# EAGLE design stm32f103_fc (EAGLE 9.3.0)
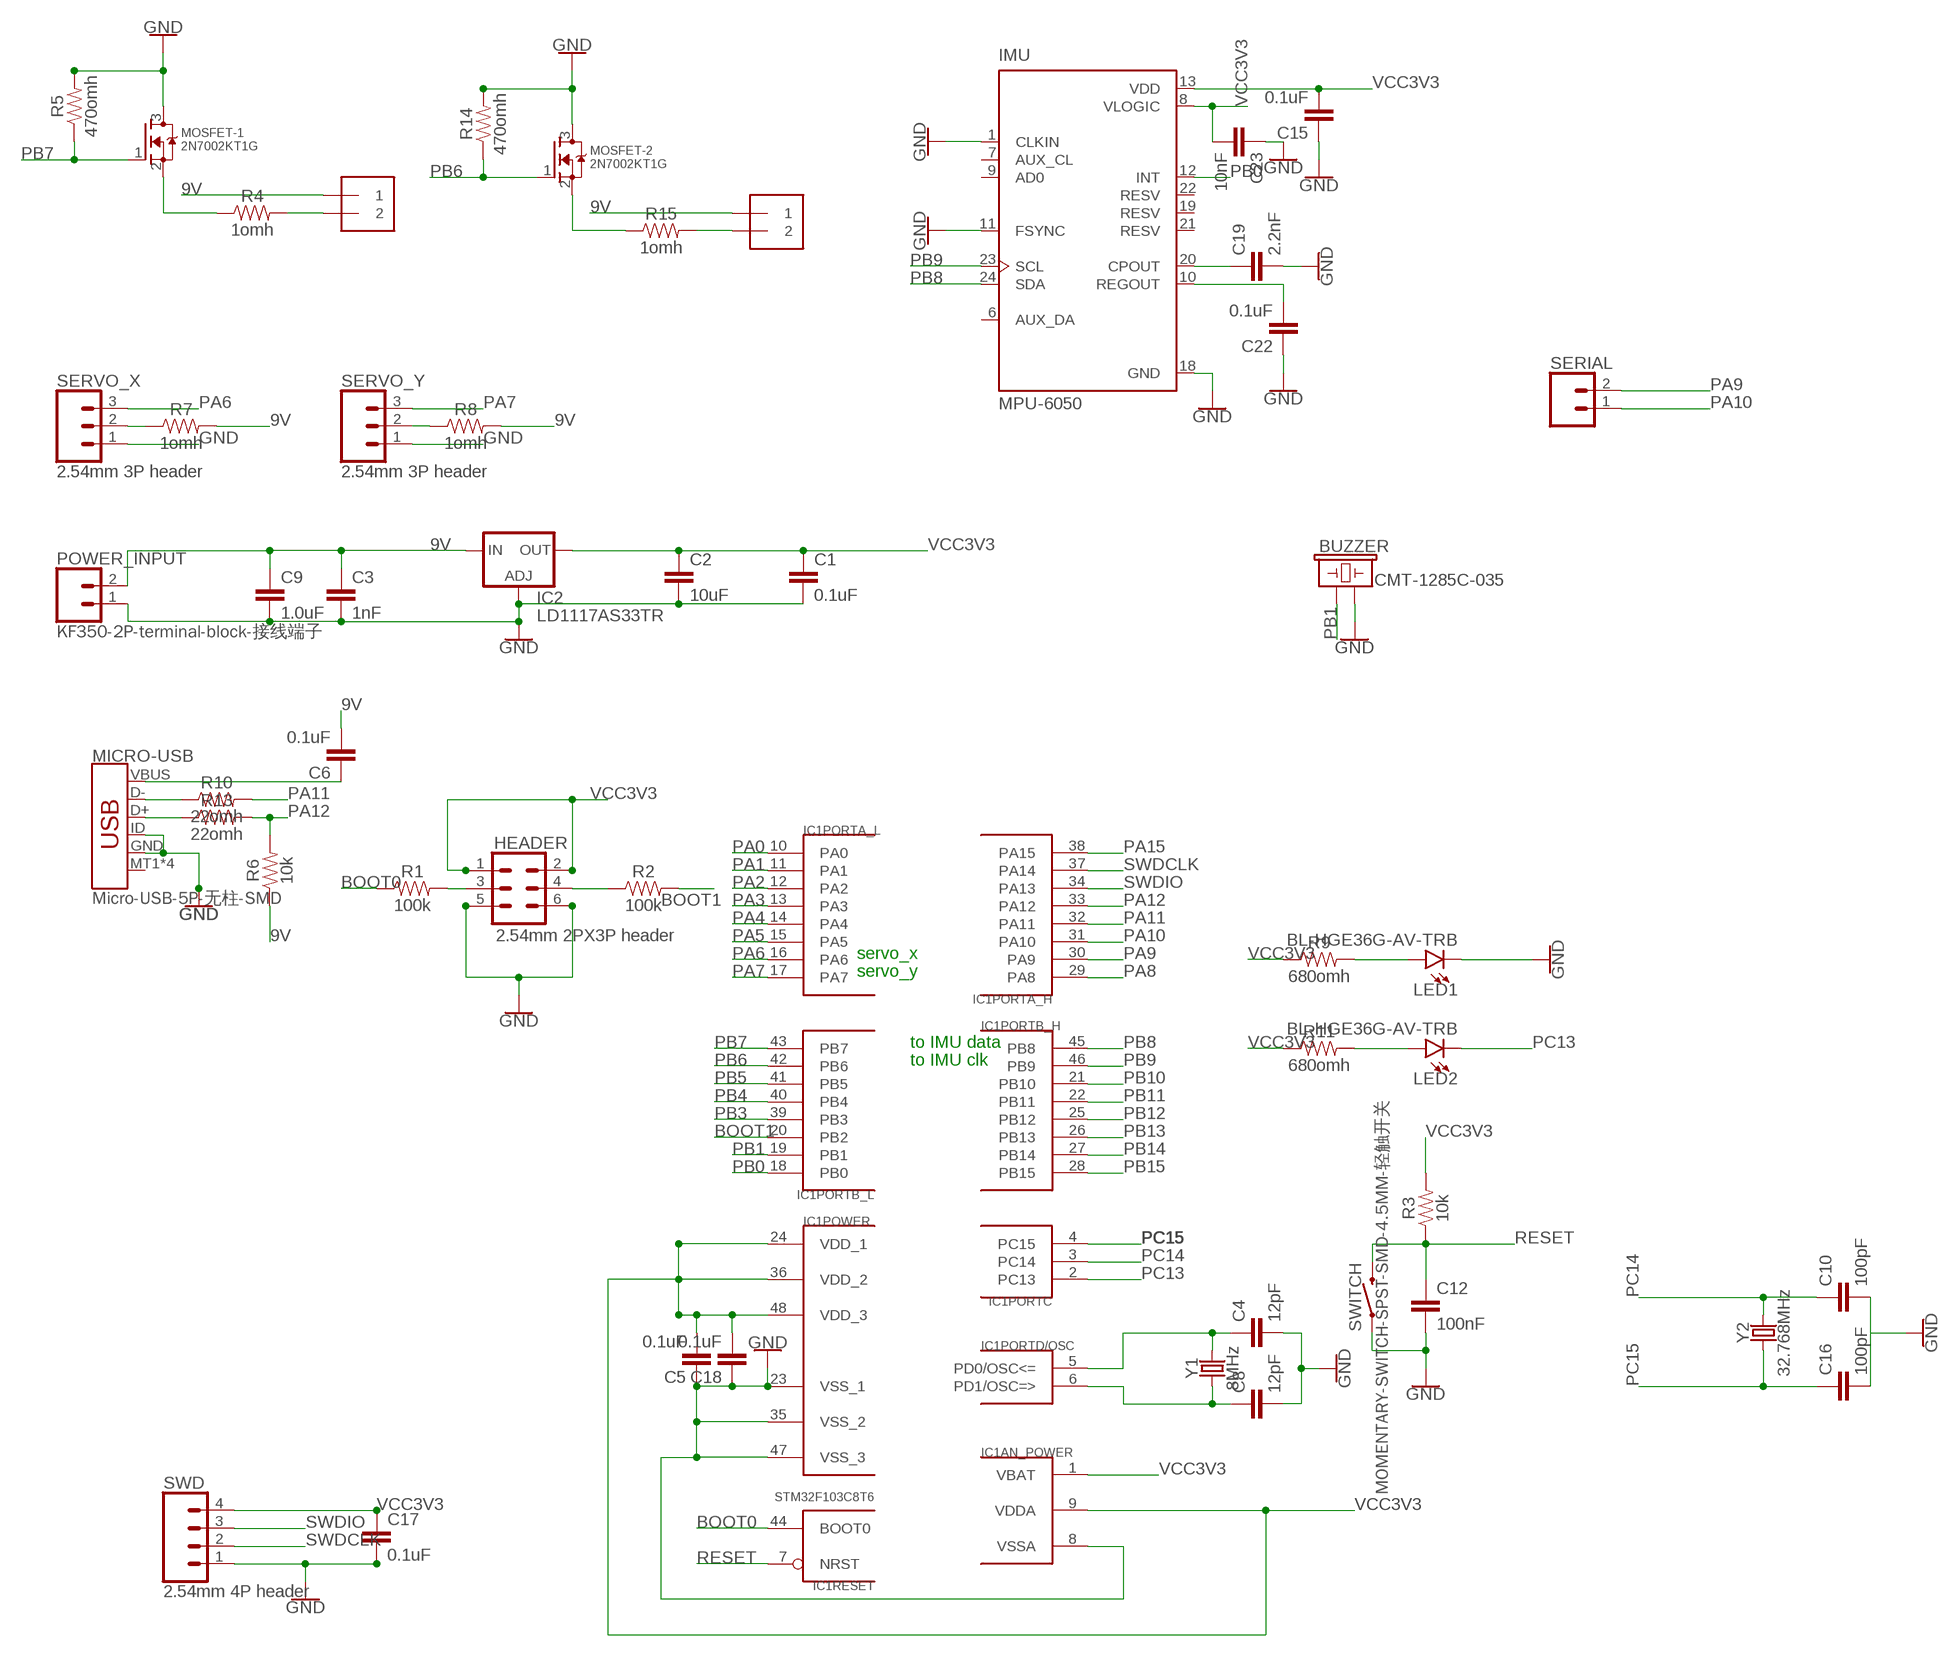
[diagram p0: schematic, sheet 1]

## Parts
BUZZER  CMT-1285C-035  BUZZER-PTH  [BUZZER-12MM]
C1  0.1uF  0.1UF-0603-25V-(+80/-20%)  [0603]
C2  10uF  10UF-0603-6.3V-20%  [0603]
C3  1nF  1.0NF/1000PF-0603-50V-10%  [0603]
C4  12pF  12PF-0603-50V-5%  [0603]
C5  0.1uF  0.1UF-0402-16V-10%  [0402]
C6  0.1uF  0.1UF-0603-25V-(+80/-20%)  [0603]
C8  12pF  12PF-0603-50V-5%  [0603]
C9  1.0uF  1.0UF-0603-16V-10%  [0603]
C10  100pF  100PF-0603-50V-5%  [0603]
C12  100nF  0.1UF-0603-25V-(+80/-20%)  [0603]
C15  0.1uF  0.1UF-0402-16V-10%  [0402]
C16  100pF  100PF-0603-50V-5%  [0603]
C17  0.1uF  0.1UF-0603-25V-(+80/-20%)  [0603]
C18  0.1uF  0.1UF-0402-16V-10%  [0402]
C19  2.2nF  2.2NF/2200PF-0603-50V-10%  [0603]
C22  0.1uF  0.1UF-0402-16V-10%  [0402]
C23  10nF  10NF-0603-50V-10%  [0603]
HEADER  2.54mm 2PX3P header  CONN_03X2NO_SILK  [2X3-NS]
IC1  STM32F103C8T6  STM32F10XCXT6  [TQFP48]
IC2  LD1117AS33TR  LD117AS33TR  [SOT223]
IMU  MPU-6050  [QFN50P400X400X95-24N]
LED1  BL-HGE36G-AV-TRB  LED-GREEN0603  [LED-0603]
LED2  BL-HGE36G-AV-TRB  LED-GREEN0603  [LED-0603]
MICRO-USB  Micro-USB-5P-无柱-SMD  USB_MICRO-B_SMT  [USB-MICROB]
MOSFET-1  2N7002KT1G  MOSFET-NREFLOW  [SOT23]
MOSFET-2  2N7002KT1G  MOSFET-NREFLOW  [SOT23]
POWER_INPUT  KF350-2P-terminal-block-接线端子  CONN_023.5MM  [SCREWTERMINAL-3.5MM-2]
PY1  1X2-3.5MM KF350 terminal block  1X2-3.5MM  [1X2-3.5MM]
PY2  1X2-3.5MM KF350 terminal block  1X2-3.5MM  [1X2-3.5MM]
R1  100k  100KOHM-0603-1/10W-1%  [0603]
R2  100k  100KOHM-0603-1/10W-1%  [0603]
R3  10k  10KOHM-0603-1/10W-1%  [0603]
R4  1omh  1OHM-0603-1/10W-1%  [0603]
R5  470omh  470OHM-0603-1/10W-1%  [0603]
R6  10k  10KOHM-0603-1/10W-1%  [0603]
R7  1omh  1OHM-0603-1/10W-1%  [0603]
R8  1omh  1OHM-0603-1/10W-1%  [0603]
R9  680omh  680OHM-0603-1/10W-5%  [0603]
R10  22omh  22OHM-0603-1/10W-1%  [0603]
R11  680omh  680OHM-0603-1/10W-5%  [0603]
R13  22omh  22OHM-0603-1/10W-1%  [0603]
R14  470omh  470OHM-0603-1/10W-1%  [0603]
R15  1omh  1OHM-0603-1/10W-1%  [0603]
SERIAL  CONN_02  [1X02]
SERVO_X  2.54mm 3P header  CONN_03  [1X03]
SERVO_Y  2.54mm 3P header  CONN_03  [1X03]
SWD  2.54mm 4P header  CONN_04  [1X04]
SWITCH  MOMENTARY-SWITCH-SPST-SMD-4.5MM-轻触开关  MOMENTARY-SWITCH-SPST-SMD-6.0X3.5MM  [TACTILE_SWITCH_SMD_6.0X3.5MM]
Y1  8MHz  CRYSTALPTH-HC49US  [HC49US]
Y2  32.768MHz  CRYSTALPTH-HC49US  [HC49US]

## Nets
9V: C3.1 C6.2 C9.1 IC2.3(IN) POWER_INPUT.2 PY1.1 PY2.1 R6.1 R7.2 R8.2
BOOT0: IC1.44(RESET:BOOT0) R1.1
BOOT1: IC1.20(PORTB_L:PB2) R2.2
GND: BUZZER.- C1.2 C2.2 C3.2 C4.2 C5.1 C8.2 C9.2 C10.2 C12.2 C15.1 C16.2 C17.2 C18.1 C19.2 C22.1 C23.1 HEADER.5 HEADER.6 IC1.8(AN_POWER:VSSA) IC1.23(POWER:VSS_1) IC1.35(POWER:VSS_2) IC1.47(POWER:VSS_3) IC2.1(ADJ) IMU.1(CLKIN) IMU.11(FSYNC) IMU.18(GND) LED1.C MICRO-USB.GND MICRO-USB.ID MOSFET-1.3(D) MOSFET-2.3(D) POWER_INPUT.1 R5.2 R14.2 SERVO_X.1 SERVO_Y.1 SWD.1 SWITCH.1
N$1: HEADER.3 R1.2
N$2: HEADER.4 R2.1
N$3: LED1.A R9.2
N$4: C19.1 IMU.20(CPOUT)
N$5: LED2.A R11.2
N$6: MICRO-USB.D- R10.1
N$7: C4.1 IC1.5(PORTD/OSC:PD0/OSC<=) Y1.2
N$8: MICRO-USB.D+ R13.1
N$9: C8.1 IC1.6(PORTD/OSC:PD1/OSC=>) Y1.1
N$10: C6.1 MICRO-USB.VBUS
N$11: PY1.2 R4.2
N$12: PY2.2 R15.2
N$13: MOSFET-2.2(S) R15.1
N$14: MOSFET-1.2(S) R4.1
N$16: C22.2 IMU.10(REGOUT)
N$17: R7.1 SERVO_X.2
N$18: R8.1 SERVO_Y.2
PA0: IC1.10(PORTA_L:PA0)
PA1: IC1.11(PORTA_L:PA1)
PA2: IC1.12(PORTA_L:PA2)
PA3: IC1.13(PORTA_L:PA3)
PA4: IC1.14(PORTA_L:PA4)
PA5: IC1.15(PORTA_L:PA5)
PA6: IC1.16(PORTA_L:PA6) SERVO_X.3
PA7: IC1.17(PORTA_L:PA7) SERVO_Y.3
PA8: IC1.29(PORTA_H:PA8)
PA9: IC1.30(PORTA_H:PA9) SERIAL.2
PA10: IC1.31(PORTA_H:PA10) SERIAL.1
PA11: IC1.32(PORTA_H:PA11) R10.2
PA12: IC1.33(PORTA_H:PA12) R6.2 R13.2
PA15: IC1.38(PORTA_H:PA15)
PB0: IC1.18(PORTB_L:PB0) IMU.12(INT)
PB1: BUZZER.+ IC1.19(PORTB_L:PB1)
PB3: IC1.39(PORTB_L:PB3)
PB4: IC1.40(PORTB_L:PB4)
PB5: IC1.41(PORTB_L:PB5)
PB6: IC1.42(PORTB_L:PB6) MOSFET-2.1(G) R14.1
PB7: IC1.43(PORTB_L:PB7) MOSFET-1.1(G) R5.1
PB8: IC1.45(PORTB_H:PB8) IMU.24(SDA)
PB9: IC1.46(PORTB_H:PB9) IMU.23(SCL)
PB10: IC1.21(PORTB_H:PB10)
PB11: IC1.22(PORTB_H:PB11)
PB12: IC1.25(PORTB_H:PB12)
PB13: IC1.26(PORTB_H:PB13)
PB14: IC1.27(PORTB_H:PB14)
PB15: IC1.28(PORTB_H:PB15)
PC13: IC1.2(PORTC:PC13) LED2.C
PC14: C10.1 IC1.3(PORTC:PC14) Y2.2
PC15: C16.1 IC1.4(PORTC:PC15) Y2.1
RESET: C12.1 IC1.7(RESET:NRST) R3.1 SWITCH.2
SWDCLK: IC1.37(PORTA_H:PA14) SWD.2
SWDIO: IC1.34(PORTA_H:PA13) SWD.3
VCC3V3: C1.1 C2.1 C5.2 C15.2 C17.1 C18.2 C23.2 HEADER.1 HEADER.2 IC1.1(AN_POWER:VBAT) IC1.9(AN_POWER:VDDA) IC1.24(POWER:VDD_1) IC1.36(POWER:VDD_2) IC1.48(POWER:VDD_3) IC2.4(OUT) IMU.8(VLOGIC) IMU.13(VDD) R3.2 R9.1 R11.1 SWD.4
Unconnected: IMU.6(AUX_DA) IMU.7(AUX_CL) IMU.9(AD0) IMU.19(RESV) IMU.21(RESV) IMU.22(RESV) MICRO-USB.MT1(SHIELD) MICRO-USB.MT2(SHIELD) MICRO-USB.P$1(SHIELD) MICRO-USB.P$2(SHIELD)

## Notes on the sheet
- servo_x
- servo_y
- to IMU data
- to IMU clk

## Library data of the parts
BUZZER = SparkFun-Electromechanical:BUZZER: Buzzer Small round buzzers that operate around the audible 2kHz range. You can use these as speakers to create simple music or user interfaces. Variant Overview: PTH - Mini Speaker - PC Mount 12mm 2.048kHz <https://www.sparkfun.com/products/7950> PTH_KIT - Mini Speaker - PC Mount 12mm 2.048kHz <https://www.sparkfun.com/products/7950> KIT simplifies soldering by adding stop mask to one side of the pads. PTH_NO_SILK - Mini Speaker - PC Mount 12mm 2.048kHz <https://www.sparkfun.com/products/7950> No silkscreen indicator of buzzer outline. PTH_KIT_NO_SILK - Mini Speaker - PC Mount 12mm 2.048kHz <https://www.sparkfun.com/products/7950> KIT package w/o silkscreen SMD - Buzzer Audio Magnetic (CCV-084B16) SMD buzzer used on, e.g. the LilyPad Buzzer <https://www.sparkfun.com/products/8463> and RFID USB Reader <https://www.sparkfun.com/products/9963>. SMD_KIT - Buzzer Audio Magnetic (CCV-084B16) SMD Buzzer with elongated pins to make soldering easier. Used on the SparkFun Simon Says - Surface Mount Soldering Kit <https://www.sparkfun.com/products/10935>.; PROD_ID: COMP-08253; SF_SKU: COM-07950
C1 C6 C17 = SparkFun-Capacitors:0.1UF: 0.1µF ceramic capacitors A capacitor is a passive two-terminal electrical component used to store electrical energy temporarily in an electric field.; PROD_ID: CAP-00810
C2 = SparkFun-Capacitors:10UF: 10.0µF ceramic capacitors A capacitor is a passive two-terminal electrical component used to store electrical energy temporarily in an electric field.; PROD_ID: CAP-11015
C3 = SparkFun-Capacitors:1.0NF/1000PF: 1nF/1,000pF ceramic capacitors A capacitor is a passive two-terminal electrical component used to store electrical energy temporarily in an electric field.; PROD_ID: CAP-07886
C4 C8 = SparkFun-Capacitors:12PF: 12pF ceramic capacitors A capacitor is a passive two-terminal electrical component used to store electrical energy temporarily in an electric field.; PROD_ID: CAP-09137
C5 C15 C18 C22 = SparkFun-Capacitors:0.1UF: 0.1µF ceramic capacitors A capacitor is a passive two-terminal electrical component used to store electrical energy temporarily in an electric field.; PROD_ID: CAP-12416
C9 = SparkFun-Capacitors:1.0UF: 1µF ceramic capacitors A capacitor is a passive two-terminal electrical component used to store electrical energy temporarily in an electric field.; PROD_ID: CAP-00868
C10 C16 = SparkFun-Capacitors:100PF: 100pF/0.1nF ceramic capacitors A capacitor is a passive two-terminal electrical component used to store electrical energy temporarily in an electric field.; PROD_ID: CAP-07883
C12 = SparkFun-Capacitors:0.1UF: 0.1µF ceramic capacitors A capacitor is a passive two-terminal electrical component used to store electrical energy temporarily in an electric field.; PROD_ID: CAP-00810; VALUE: 0.1uF
C19 = SparkFun-Capacitors:2.2NF/2200PF: 2.2nF/2,200pF ceramic capacitors A capacitor is a passive two-terminal electrical component used to store electrical energy temporarily in an electric field.; PROD_ID: CAP-07877
C23 = SparkFun-Capacitors:10NF: 0.01uF/10nF/10,000pF ceramic capacitors A capacitor is a passive two-terminal electrical component used to store electrical energy temporarily in an electric field. CAP-09321; PROD_ID: CAP-00867
HEADER = SparkFun-Connectors:CONN_03X2: Multi connection point. Often used as Generic Header-pin footprint for 0.1 inch spaced/style header connections You can populate with any combo of single row headers, but if you'd like an exact match, check these: Header - 2x3 (Male, 0.1") <https://www.sparkfun.com/products/12807> (PRT-12807) Header - 2x3 (Female, 0.1") <https://www.sparkfun.com/products/13010> (PRT-13010) 2x3 Pin Shrouded Header <https://www.sparkfun.com/products/10877> (PRT-10877) On any of the 0.1 inch spaced packages, you can populate with these: Break Away Headers - Straight <https://www.sparkfun.com/products/116> (PRT-00116) Break Away Male Headers - Right Angle <https://www.sparkfun.com/products/553> (PRT-00553) Female Headers <https://www.sparkfun.com/products/115> (PRT-00115) Break Away Headers - Machine Pin <https://www.sparkfun.com/products/117> (PRT-00117) Break Away Female Headers - Swiss Machine Pin <https://www.sparkfun.com/products/743> (PRT-00743) Special note: the shrouded connector mates well with our 3x2 ribbon cables: Ribbon Crimp Connector - 6-pin (2x3, Female) <https://www.sparkfun.com/products/10651> (PRT-10651) Ribbon Cable - 6 wire (15ft) <https://www.sparkfun.com/products/10646> (PRT-10646)
IC1 = stm32:STM32F10XCXT6: ST STM32F101/103 48pin LQFP
IC2 = v-reg:LD117A?*: Low drop fixed and adjustable positive voltage regulators 1 A Source: http://www.st.com/stonline/products/literature/ds/7194/ld1117axx.pdf
IMU = MPU-6050:MPU-6050: MPU-6050 Six-Axis (Gyro + Accelerometer) MEMS MotionTracking™ Devices; AVAILABILITY: Unavailable; DESCRIPTION: 3-axis gyroscope, 3-axis accelerometer in a 4x4x0.9 housing; MF: TDK InvenSense; MP: MPU-6050; PACKAGE: QFN-24 InvenSense; PRICE: None
LED1 LED2 = SparkFun-LED:LED-GREEN: Green SMD LED Used in manufacturing of various products at SparkFun Packages: 0603 - SMD 0603 package [Product Link] <http://www.futureelectronics.com/en/technologies/semiconductors/optoelectronics/leds/Pages/9894312-LTST-C190GKT.aspx?CrossPart=HSMG-C190&IM=0> LilyPad 1206 - SMD1206 LilyPad package [Product Link] <http://www.futureelectronics.com/en/Technologies/Product.aspx?ProductID=IN150NGHARVATEKCORPORATION2049943&IM=0> 1206 - SMD1206 package [Product Link] <http://www.futureelectronics.com/en/technologies/semiconductors/optoelectronics/leds/Pages/8315665-LTST-C150KGKT.aspx?IM=0> 1206 Bottom Mount -SMD 1206 Bottom Mount [Product Link] <http://www.digikey.com/product-detail/en/lite-on-inc/LTST-C230KGKT/160-1456-1-ND/386854> SparkFun Products: Pro Mini 328 -5V <https://www.sparkfun.com/products/821> RedBoard <https://www.sparkfun.com/products/12757> MP3 Trigger <https://www.sparkfun.com/products/13720> Makey Makey <https://www.sparkfun.com/products/11076>; PROD_ID: DIO-00821; VALUE: GREEN
MICRO-USB = SparkFun-Connectors:USB_MICRO-B: USB Type Micro-B Connector Male/female and PTH/SMT variants SparkFun Products: SparkFun microB USB Breakout <https://www.sparkfun.com/products/12035> SparkFun USB microB Plug Breakout <https://www.sparkfun.com/products/10031> SparkFun ESP8266 Thing <https://www.sparkfun.com/products/13231>; PROD_ID: CONN-09505; SF_ID: PRT-08533
MOSFET-1 MOSFET-2 = adafruit:MOSFET-N: N-Channel Mosfet 2N7002E - 60V 260mA SOT23 [Digikey: 2N7002ET1GOSTR-ND] - REEL BSH103 - 30V 850mA SOT23 [Digikey: 568-5013-1-ND]
POWER_INPUT = SparkFun-Connectors:CONN_02: Multi connection point. Often used as Generic Header-pin footprint for 0.1 inch spaced/style header connections On any of the 0.1 inch spaced packages, you can populate with these: Break Away Headers - Straight <https://www.sparkfun.com/products/116> (PRT-00116) Break Away Male Headers - Right Angle <https://www.sparkfun.com/products/553> (PRT-00553) Female Headers <https://www.sparkfun.com/products/115> (PRT-00115) Break Away Headers - Machine Pin <https://www.sparkfun.com/products/117> (PRT-00117) Break Away Female Headers - Swiss Machine Pin <https://www.sparkfun.com/products/743> (PRT-00743) For SCREWTERMINALS and SPRING TERMINALS visit here: Screw Terimnals on SparkFun.com <https://www.sparkfun.com/search/results?term=Screw+Terminals> (5mm/3.5mm/2.54mm spacing) This device is also useful as a general connection point to wire up your design to another part of your project. Our various solder wires solder well into these plated through hole pads. Hook-Up Wire - Assortment (Stranded, 22 AWG) <https://www.sparkfun.com/products/11375> (PRT-11375) Hook-Up Wire - Assortment (Solid Core, 22 AWG) <https://www.sparkfun.com/products/11367> (PRT-11367) View the entire wire category on our website here <https://www.sparkfun.com/categories/141> Special notes: Molex polarized connector foot print use with: PRT-08233 with associated crimp pins and housings. 2.54_SCREWTERM for use with PRT-10571. 3.5mm Screw Terminal footprints for PRT-08084 5mm Screw Terminal footprints for use with PRT-08432; PROD_ID: CONN-08399
PY1 PY2 = adafruit:1X2: 3.5mm Terminal block http://www.ladyada.net/library/pcb/eaglelibrary.html
R1 R2 = SparkFun-Resistors:100KOHM: 100kΩ resistor A resistor is a passive two-terminal electrical component that implements electrical resistance as a circuit element. Resistors act to reduce current flow, and, at the same time, act to lower voltage levels within circuits. - Wikipedia; PROD_ID: RES-07828
R3 R6 = SparkFun-Resistors:10KOHM: 10kΩ resistor A resistor is a passive two-terminal electrical component that implements electrical resistance as a circuit element. Resistors act to reduce current flow, and, at the same time, act to lower voltage levels within circuits. - Wikipedia; PROD_ID: RES-00824
R4 R7 R8 R15 = SparkFun-Resistors:1OHM: 1Ω resistor A resistor is a passive two-terminal electrical component that implements electrical resistance as a circuit element. Resistors act to reduce current flow, and, at the same time, act to lower voltage levels within circuits. - Wikipedia; PROD_ID: RES-08269; VALUE: 1
R5 R14 = SparkFun-Resistors:470OHM: 470Ω resistor A resistor is a passive two-terminal electrical component that implements electrical resistance as a circuit element. Resistors act to reduce current flow, and, at the same time, act to lower voltage levels within circuits. - Wikipedia; PROD_ID: RES-07869; VALUE: 470
R9 R11 = SparkFun-Resistors:680OHM: 680Ω resistor A resistor is a passive two-terminal electrical component that implements electrical resistance as a circuit element. Resistors act to reduce current flow, and, at the same time, act to lower voltage levels within circuits. - Wikipedia; PROD_ID: RES-09333; VALUE: 680
R10 R13 = SparkFun-Resistors:22OHM: 22Ω resistor A resistor is a passive two-terminal electrical component that implements electrical resistance as a circuit element. Resistors act to reduce current flow, and, at the same time, act to lower voltage levels within circuits. - Wikipedia; PROD_ID: RES-08698; VALUE: 22
SERIAL = SparkFun-Connectors:CONN_02: Multi connection point. Often used as Generic Header-pin footprint for 0.1 inch spaced/style header connections On any of the 0.1 inch spaced packages, you can populate with these: Break Away Headers - Straight <https://www.sparkfun.com/products/116> (PRT-00116) Break Away Male Headers - Right Angle <https://www.sparkfun.com/products/553> (PRT-00553) Female Headers <https://www.sparkfun.com/products/115> (PRT-00115) Break Away Headers - Machine Pin <https://www.sparkfun.com/products/117> (PRT-00117) Break Away Female Headers - Swiss Machine Pin <https://www.sparkfun.com/products/743> (PRT-00743) For SCREWTERMINALS and SPRING TERMINALS visit here: Screw Terimnals on SparkFun.com <https://www.sparkfun.com/search/results?term=Screw+Terminals> (5mm/3.5mm/2.54mm spacing) This device is also useful as a general connection point to wire up your design to another part of your project. Our various solder wires solder well into these plated through hole pads. Hook-Up Wire - Assortment (Stranded, 22 AWG) <https://www.sparkfun.com/products/11375> (PRT-11375) Hook-Up Wire - Assortment (Solid Core, 22 AWG) <https://www.sparkfun.com/products/11367> (PRT-11367) View the entire wire category on our website here <https://www.sparkfun.com/categories/141> Special notes: Molex polarized connector foot print use with: PRT-08233 with associated crimp pins and housings. 2.54_SCREWTERM for use with PRT-10571. 3.5mm Screw Terminal footprints for PRT-08084 5mm Screw Terminal footprints for use with PRT-08432
SERVO_X SERVO_Y = SparkFun-Connectors:CONN_03: Multi connection point. Often used as Generic Header-pin footprint for 0.1 inch spaced/style header connections On any of the 0.1 inch spaced packages, you can populate with these: Break Away Headers - Straight <https://www.sparkfun.com/products/116> (PRT-00116) Break Away Male Headers - Right Angle <https://www.sparkfun.com/products/553> (PRT-00553) Female Headers <https://www.sparkfun.com/products/115> (PRT-00115) Break Away Headers - Machine Pin <https://www.sparkfun.com/products/117> (PRT-00117) Break Away Female Headers - Swiss Machine Pin <https://www.sparkfun.com/products/743> (PRT-00743) Stackable Header - 3 Pin (Female, 0.1") <https://www.sparkfun.com/products/13875> (PRT-13875) For SCREWTERMINALS and SPRING TERMINALS visit here: Screw Terimnals on SparkFun.com <https://www.sparkfun.com/search/results?term=Screw+Terminals> (5mm/3.5mm/2.54mm spacing) This device is also useful as a general connection point to wire up your design to another part of your project. Our various solder wires solder well into these plated through hole pads. Hook-Up Wire - Assortment (Stranded, 22 AWG) <https://www.sparkfun.com/products/11375> (PRT-11375) Hook-Up Wire - Assortment (Solid Core, 22 AWG) <https://www.sparkfun.com/products/11367> (PRT-11367) View the entire wire category on our website here <https://www.sparkfun.com/categories/141> Special notes: Molex polarized connector foot print use with SKU : PRT-08232 with associated crimp pins and housings.
SWD = SparkFun-Connectors:CONN_04: Multi connection point. Often used as Generic Header-pin footprint for 0.1 inch spaced/style header connections On any of the 0.1 inch spaced packages, you can populate with these: Break Away Headers - Straight <https://www.sparkfun.com/products/116> (PRT-00116) Break Away Male Headers - Right Angle <https://www.sparkfun.com/products/553> (PRT-00553) Female Headers <https://www.sparkfun.com/products/115> (PRT-00115) Break Away Headers - Machine Pin <https://www.sparkfun.com/products/117> (PRT-00117) Break Away Female Headers - Swiss Machine Pin <https://www.sparkfun.com/products/743> (PRT-00743) For SCREWTERMINALS and SPRING TERMINALS visit here: Screw Terimnals on SparkFun.com <https://www.sparkfun.com/search/results?term=Screw+Terminals> (5mm/3.5mm/2.54mm spacing) This device is also useful as a general connection point to wire up your design to another part of your project. Our various solder wires solder well into these plated through hole pads. Hook-Up Wire - Assortment (Stranded, 22 AWG) <https://www.sparkfun.com/products/11375> (PRT-11375) Hook-Up Wire - Assortment (Solid Core, 22 AWG) <https://www.sparkfun.com/products/11367> (PRT-11367) View the entire wire category on our website here <https://www.sparkfun.com/categories/141> Special notes: Molex polarized connector foot print use with SKU : PRT-08231 with associated crimp pins and housings. 1MM SMD Version SKU: PRT-10208; PROD_ID: CONN-09696
SWITCH = SparkFun-Switches:MOMENTARY-SWITCH-SPST: Momentary Switch (Pushbutton) - SPST Normally-open (NO) SPST momentary switches (buttons, pushbuttons). Variants PTH-12MM - 12mm square, through-hole Momentary Pushbutton Switch - 12mm Square <https://www.sparkfun.com/products/9190> (COM-09190) PTH-6.0MM, PTH-6.0MM-KIT - 6.0mm square, through-hole Mini Pushbutton Switch <https://www.sparkfun.com/products/97> (COM-00097) KIT package intended for soldering kit's - only one side of pads' copper is exposed. PTH-RIGHT-ANGLE-KIT - Right-angle, through-hole Right Angle Tactile Button <https://www.sparkfun.com/products/10791> - Used on SparkFun BigTime Watch Kit <https://www.sparkfun.com/products/11734> SMD-12MM - 12mm square, surface-mount Tactile Button - SMD (12mm) <https://www.sparkfun.com/products/12993> (COM-12993) Used on SparkFun PicoBoard <https://www.sparkfun.com/products/11888> SMD-4.5MM - 4.5mm Square Trackball Switch Used on SparkFun Blackberry Trackballer Breakout <https://www.sparkfun.com/products/13169> SMD-4.6MMX2.8MM - 4.60mm x 2.80mm, surface mount Used on SparkFun SAMD21 Mini Breakout <https://www.sparkfun.com/products/13664> SMD-5.2MM, SMD-5.2-REDUNDANT - 5.2mm square, surface-mount Mini Pushbutton Switch - SMD <https://www.sparkfun.com/products/8720> (COM-08720) Used on Arduino Pro Mini <https://www.sparkfun.com/products/11114> REDUNDANT package connects both switch circuits together SMD-6.0X3.5MM - 6.0 x 3.5mm, surface mount Momentary Reset Switch SMD <https://www.sparkfun.com/products/8229> (COM-08229) SMD-6.2MM-TALL - 6.2mm square, surface mount Tactile Button - SMD (6mm) <https://www.sparkfun.com/products/12992> Used on SparkFun Digital Sandbox <https://www.sparkfun.com/products/12651> SMD-RIGHT-ANGLE - Right-angle, surface mount Used on SparkFun Block for Intel® Edison - Arduino <https://www.sparkfun.com/products/13036>; PROD_ID: SWCH-00815; SF_SKU: COM-08229
Y1 Y2 = SparkFun-Clocks:CRYSTAL: Crystals (Generic) These are passive quartz crystals, which can be used as a clock source for a microcontroller. Crystal's are two-terminal devices. They require external "load" capacitors to generate an oscillating signal.

## Board
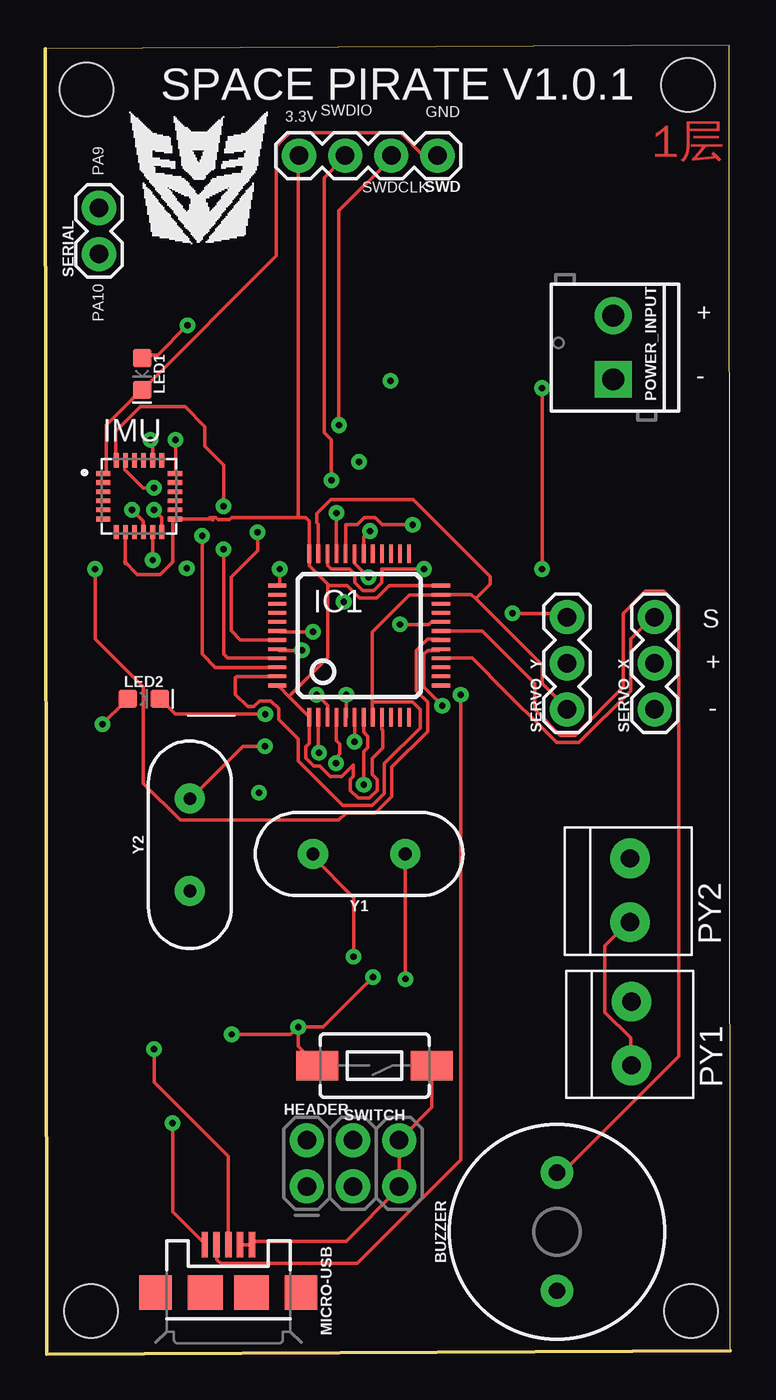
[diagram p1: board, top side]
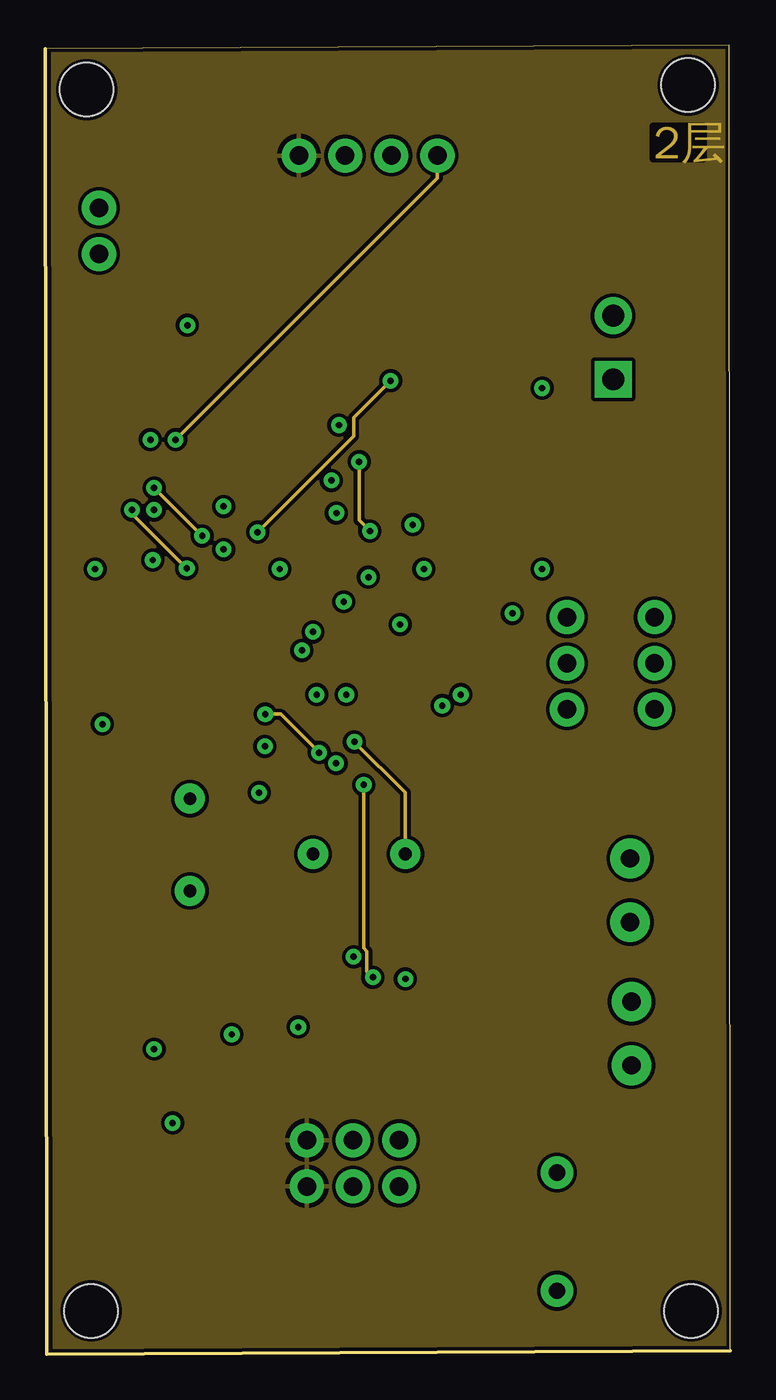
[diagram p2: board, inner layer Route2]
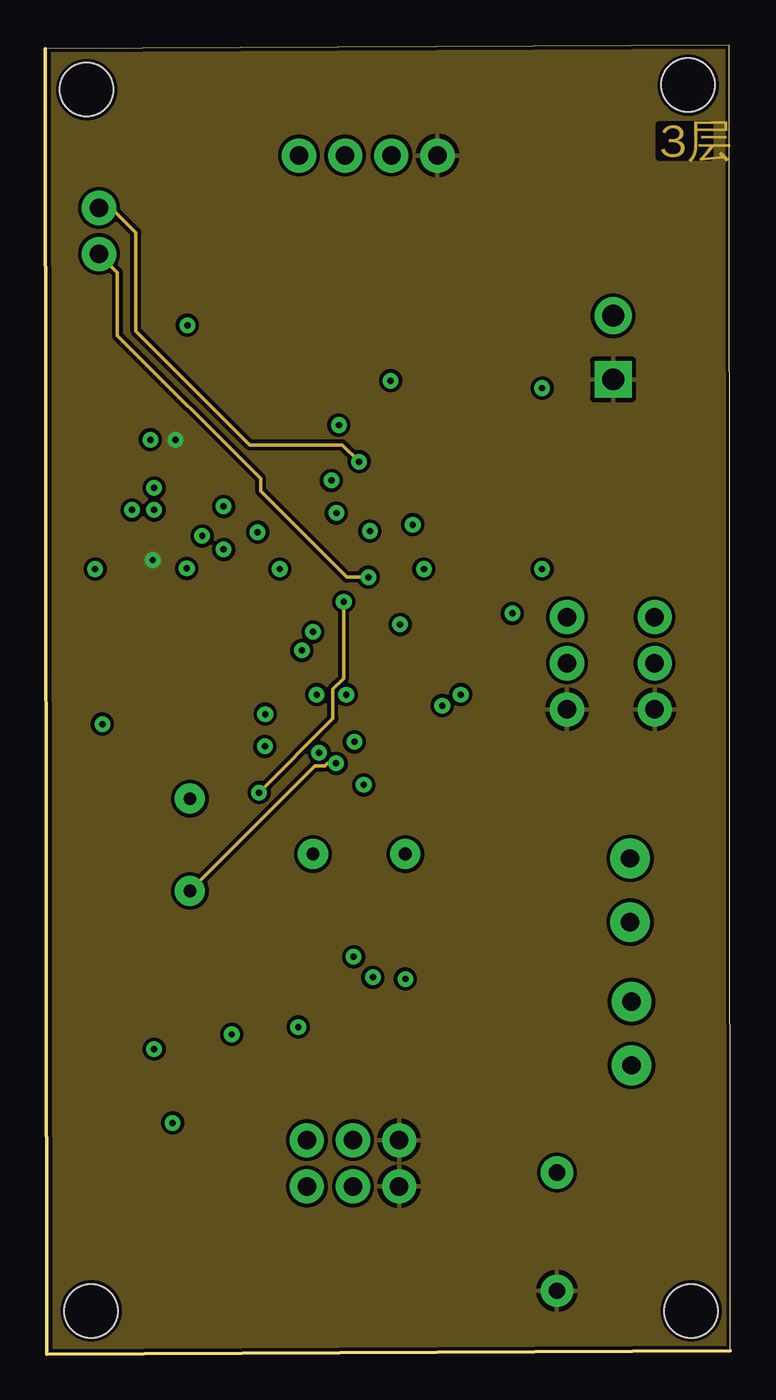
[diagram p3: board, inner layer Route15]
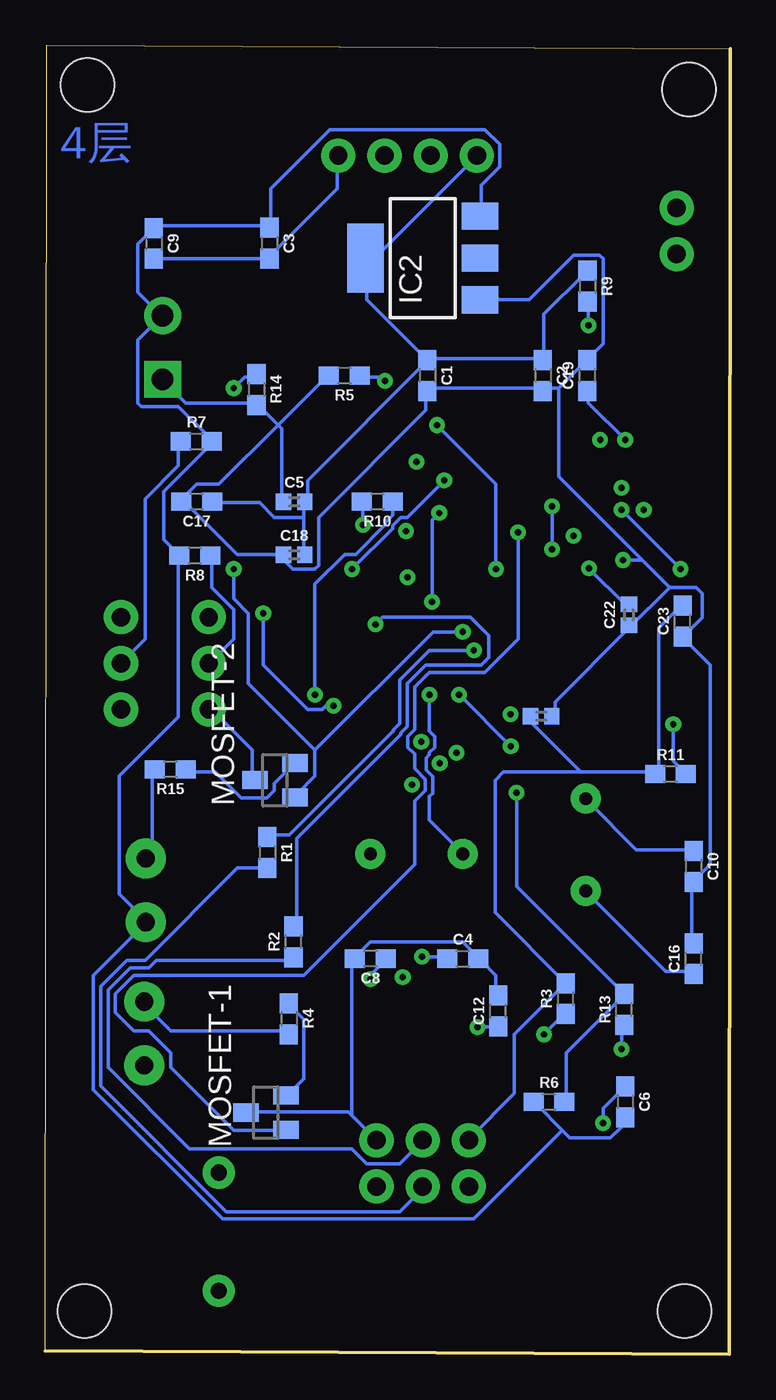
[diagram p4: board, bottom side, seen from below]

Size 37.67 x 72.01 mm. Coordinates in mm from the lower left corner, seen from the top.
Outline: 0.07,0 37.67,0.17 37.6,72.01 0,71.84 0.07,0
Copper layers (1+2*15+16): Top 0.035mm / dielectric 1.5mm / Route2 0.035mm / dielectric 0.15mm / Route15 0.035mm / dielectric 0.2mm / Bottom 0.035mm
Design rules "SparkFun *": minimum track width 8mil, minimum drill 0.35mm, track to track 8mil, track to pad 8mil, pad to pad 8mil, via to via 8mil, smd to smd 8mil, copper to edge 8mil, drill to drill 8mil, minimum pad ring 12mil, minimum via ring 10mil, stop-mask expansion 4mil, vias tented up to drill 20mil, thermal gap 10mil
Holes 2.95 mm at 2.26,69.58 35.35,69.83 2.51,2.37 35.52,2.37

### Footprints (pad centres in the part's own frame; a part is rotated, then mirrored left to right if it is on the bottom)
BUZZER-12MM = drill 0.9 pad 1.778: + 3.25,0; - -3.25,0
0603 = smd 1.1 x 1: 1 -0.85,0; 2 0.85,0
0402 = smd 0.85 x 0.9: 1 -0.58,0; 2 0.58,0
2X3-NS = drill 1.016 pad 1.88: 1 -2.54,-1.27; 2 -2.54,1.27; 3 0,-1.27; 4 0,1.27; 5 2.54,-1.27; 6 2.54,1.27
TQFP48 = smd 0.2 x 1: 1 -2.75,-4.5; 2 -2.25,-4.5; 3 -1.75,-4.5; 4 -1.25,-4.5; 5 -0.75,-4.5; 6 -0.25,-4.5; 7 0.25,-4.5; 8 0.75,-4.5; 9 1.25,-4.5; 10 1.75,-4.5; 11 2.25,-4.5; 12 2.75,-4.5; 25 2.75,4.5; 26 2.25,4.5; 27 1.75,4.5; 28 1.25,4.5; 29 0.75,4.5; 30 0.25,4.5; 31 -0.25,4.5; 32 -0.75,4.5; 33 -1.25,4.5; 34 -1.75,4.5; 35 -2.25,4.5; 36 -2.75,4.5 | smd 1 x 0.2: 13 4.5,-2.75; 14 4.5,-2.25; 15 4.5,-1.75; 16 4.5,-1.25; 17 4.5,-0.75; 18 4.5,-0.25; 19 4.5,0.25; 20 4.5,0.75; 21 4.5,1.25; 22 4.5,1.75; 23 4.5,2.25; 24 4.5,2.75; 37 -4.5,2.75; 38 -4.5,2.25; 39 -4.5,1.75; 40 -4.5,1.25; 41 -4.5,0.75; 42 -4.5,0.25; 43 -4.5,-0.25; 44 -4.5,-0.75; 45 -4.5,-1.25; 46 -4.5,-1.75; 47 -4.5,-2.25; 48 -4.5,-2.75
SOT223 = smd 1.5 x 2: 1 -2.3,-3.15; 2 0,-3.15; 3 2.3,-3.15 | smd 3.8 x 2: 4 0,3.15
QFN50P400X400X95-24N = smd 0.79 x 0.26: 1 -1.97,1.25; 2 -1.97,0.75; 3 -1.97,0.25; 4 -1.97,-0.25; 5 -1.97,-0.75; 6 -1.97,-1.25; 13 1.97,-1.25; 14 1.97,-0.75; 15 1.97,-0.25; 16 1.97,0.25; 17 1.97,0.75; 18 1.97,1.25 | smd 0.26 x 0.79: 7 -1.25,-1.97; 8 -0.75,-1.97; 9 -0.25,-1.97; 10 0.25,-1.97; 11 0.75,-1.97; 12 1.25,-1.97; 19 1.25,1.97; 20 0.75,1.97; 21 0.25,1.97; 22 -0.25,1.97; 23 -0.75,1.97; 24 -1.25,1.97
LED-0603 = smd 1 x 1: A -0.877,0; C 0.877,0
USB-MICROB = smd 1.4 x 0.35: D+ -2.65,0; D- -2.65,-0.65; GND -2.65,1.3; ID -2.65,0.65; VBUS -2.65,-1.3 | smd 1.9 x 1.8: MT1 0,-4; MT2 0,4 | smd 1.9 x 1.9: P$1 0,-1.27; P$2 0,1.27
SOT23 = smd 1 x 1.4: 1 -0.95,-1.1; 2 0.95,-1.1; 3 0,1.1
SCREWTERMINAL-3.5MM-2 = drill 1.2 pad 2.032 square: 1 0,0 | drill 1.2 pad 2.032: 2 3.5,0
1X2-3.5MM = drill 1 pad 2.184: 1 1.8,0; 2 -1.7,0
1X02 = drill 1.016 pad 1.88: 1 0,0; 2 2.54,0
1X03 = drill 1.016 pad 1.88: 1 0,0; 2 2.54,0; 3 5.08,0
1X04 = drill 1.016 pad 1.88: 1 0,0; 2 2.54,0; 3 5.08,0; 4 7.62,0
TACTILE_SWITCH_SMD_6.0X3.5MM = smd 2.3 x 1.6: 1 -3.15,0; 2 3.15,0
HC49US = drill 0.7 pad 1.651: 1 -2.54,0; 2 2.54,0

### Placement (x,y rotation side)
BUZZER  28.14,6.73 90 top
C1  16.66,53.85 270 bottom
C2  10.31,53.85 270 bottom
C3  25.35,61.12 270 bottom
C4  14.72,21.76 0 bottom
C5  23.99,46.91 0 bottom
C6  5.78,13.88 270 bottom
C8  19.8,21.76 180 bottom
C9  31.71,61.12 270 bottom
C10  2.02,26.84 270 bottom
C12  12.77,18.88 90 bottom
C15  10.4,35.09 180 bottom
C16  2.02,21.76 90 bottom
C17  29.35,46.91 180 bottom
C18  23.99,43.98 0 bottom
C19  7.86,53.85 90 bottom
C22  5.57,40.68 90 bottom
C23  2.61,40.34 90 bottom
HEADER  16.92,10.5 0 top
IC1  17.26,39.54 0 top
IC2  16.92,60.31 90 bottom
IMU  5.15,47.2 0 top
LED1  5.32,53.93 270 top
LED2  5.4,36.07 0 top
MICRO-USB  10.06,3.39 270 top
MOSFET-1  25.55,13.29 90 bottom
MOSFET-2  25.05,31.58 90 bottom
POWER_INPUT  31.23,53.64 90 top
PY1  32.24,17.69 270 top
PY2  32.16,25.57 270 top
R1  25.47,27.6 270 bottom
R2  24.03,22.69 90 bottom
R3  9.04,19.56 90 bottom
R4  24.28,18.45 270 bottom
R5  21.23,53.84 180 bottom
R6  9.97,13.88 0 bottom
R7  29.37,50.22 0 bottom
R8  29.46,43.93 180 bottom
R9  7.86,58.76 270 bottom
R10  19.42,46.91 180 bottom
R11  3.29,31.92 0 bottom
R13  5.83,18.96 90 bottom
R14  26.06,53.08 270 bottom
R15  30.8,32.18 180 bottom
SERIAL  2.95,60.53 90 top
SERVO_X  33.51,35.48 90 top
SERVO_Y  28.69,35.48 90 top
SWD  21.57,65.95 180 top
SWITCH  18.1,15.87 180 top
Y1  17.26,27.52 180 top
Y2  7.94,28.02 90 top

### Tracks (layer width: path | path; a pad name or v marks a point on that pad's centre or on a via)
9V
  Top 0.203: PY1.1 32.19,15.97 32.19,17.39 30.77,18.81 30.77,22.47 31.99,23.69 PY2.1
  Bottom 0.203: IC2.3 13.7,62.7 13.7,64.33 12.69,65.35 12.69,66.57 13.5,67.38 22.03,67.38 25.28,64.13 25.28,62.09 C3.1 25.49,62.09 31.58,62.09 C9.1 31.79,61.89 32.6,61.08 32.6,58.44 31.38,57.22 POWER_INPUT.2 31.38,57.01 32.6,55.8 32.6,52.34 32.4,52.14 30.36,52.14 28.54,50.31 R7.2 28.54,50.11 31.18,47.46 31.18,44.82 30.36,44.01 R8.2 30.36,43.81 30.36,35.07 33.62,31.82 33.62,25.32 32.19,23.89 PY2.1 32.19,23.69 35.04,20.85 35.04,14.55 27.93,7.43 14.11,7.43 9.23,12.31 | 9.23,12.31 10.65,13.73 R6.1 | 9.23,12.31 8.82,11.9 6.59,11.9 5.98,12.51 5.98,12.92 C6.2
BOOT0  (via drill 0.35)
  Top 0.203: v14.11,38.73 12.89,38.73 IC1.44
  Bottom 0.203: v14.11,38.73 16.55,38.73 18.17,37.1 18.17,34.71 18.55,34.33 18.55,34.29 24.27,28.57 25.28,28.57 R1.1
BOOT1  (via drill 0.35)
  Top 0.203: v19.51,40.15 21.09,40.15 21.23,40.29 IC1.20
  Bottom 0.203: v19.51,40.15 19.1,40.56 14.31,40.56 13.3,39.54 13.3,38.32 13.7,37.91 16.75,37.91 17.77,36.9 17.77,34.54 18.14,34.17 18.14,34.09 23.86,28.36 23.86,23.69 R2.2
GND  (via drill 0.35)
  Top 0.203: IC1.8 17.97,35.07 17.97,35.88 | IMU.11 v5.9,43.69 v5.91,43.68 | 4.76,52.54 5.17,52.95 LED1.C | IMU.1 3.34,48.48 3.34,51.12 5.27,53.06 LED1.C | MICRO-USB.ID 10.86,6.01 11.26,6.01 MICRO-USB.GND 11.47,6.21 16.55,6.21 19.39,9.06 HEADER.5 HEADER.6 21.25,13.56 SWITCH.1 | 23.66,41.57 27.32,37.91 27.32,36.9 28.54,35.68 SERVO_Y.1 | 23.66,41.57 23.46,41.77 23.4,41.79 IC1.23 21.63,41.77 20,41.77 17.97,39.74 17.97,35.88 | 23.66,41.57 24.47,42.38 24.47,42.79 20.25,47.02 15.69,47.02 14.92,46.25 14.92,46.04 14.93,46.03 14.93,45.75 15.01,45.67 IC1.35 | 17.97,35.88 20.2,35.88 20.61,35.48 20.61,34.46 18.65,32.5 18.65,30.85 17.98,30.18 16.36,30.18 13.91,32.63 13.91,33.84 12.82,34.93 12.82,35.52 12.39,35.95 11.79,35.95 11.46,35.62 11.12,35.62 10.45,36.29 10.45,37.22 10.52,37.29 IC1.47 | IMU.18 7.16,48.49 v7.16,50.31 | SWD.1 20.79,65.95 19.54,67.2 13.43,67.2 12.7,66.47 12.7,60.44 LED1.C
  Route2 0.203: v7.16,50.31 21.57,64.72 SWD.1
  Bottom 0.203: 9.43,53.15 10.25,53.15 C2.2 10.45,53.15 16.55,53.15 C1.2 16.75,52.95 16.75,51.93 22.64,46.04 22.64,43.4 22.85,43.2 24.06,43.2 24.67,43.81 C18.1 24.67,44.01 27.11,44.01 30.16,47.06 | 9.43,53.15 8.01,54.58 C19.2 7.81,54.78 7,55.59 7,60.27 7.2,60.47 8.62,60.47 11.06,58.03 13.7,58.03 IC2.1 | C16.2 2.12,22.67 2.12,25.93 C10.2 1.92,26.13 1.1,26.94 1.1,37.91 2.53,39.34 C23.1 2.53,39.54 1.54,40.52 1.54,41.86 1.87,42.18 3.34,42.18 | 5.57,39.95 9.64,35.88 9.64,35.27 C15.1 | 5.57,39.95 3.34,42.18 | 5.57,39.95 C22.1 | 9.43,53.15 9.43,48.28 4.85,43.69 | 3.34,42.18 4.85,43.69 | 24.88,51.12 25.89,52.14 R14.2 26.1,52.34 29.96,52.34 31.18,53.56 POWER_INPUT.1 | 24.88,51.12 24.67,50.92 24.67,47.06 C5.1 | 24.88,51.12 22.24,53.76 R5.2 | 30.16,47.06 29.35,47.87 28.13,47.87 24.88,51.12 | 30.16,47.06 C17.2 | C12.2 12.89,19.83 12.89,20.85 13.7,21.66 C4.2 13.9,21.86 14.72,22.67 19.8,22.67 20.61,21.86 C8.2 20.81,21.66 20.81,13.12 | C9.2 31.58,60.27 25.49,60.27 C3.2 25.28,60.47 21.63,64.13 21.63,65.75 SWD.1 | MOSFET-2.3 26.3,31.61 26.3,33.24 28.54,35.48 SERVO_Y.1 | 20.81,13.12 19.59,11.9 HEADER.6 | 20.81,13.12 21.02,13.33 26.5,13.33 MOSFET-1.3 | v5.9,43.69 4.85,43.69
  pour Route15: -8.48,77.72 47.22,77.72 47.22,-0.85 -8.48,-0.85
N$1
  Bottom 0.203: R1.2 25.49,26.74 27.11,26.74 32.19,21.66 33.21,21.66 34.63,20.24 34.63,14.75 27.72,7.84 18.17,7.84 16.95,9.06 HEADER.3
N$2
  Bottom 0.203: R2.1 24.06,21.66 31.58,21.66 31.99,21.25 33.01,21.25 34.22,20.03 34.22,15.77 29.75,11.29 20.81,11.29 20,10.48 18.17,10.48 16.95,11.7 HEADER.4
N$3  (via drill 0.35)
  Top 0.203: v7.81,56.61 6.18,54.98 5.37,54.98 LED1.A
  Bottom 0.203: v7.81,56.61 7.81,57.83 R9.2
N$4  (via drill 0.35)
  Top 0.203: IMU.20 5.9,50.31 v5.78,50.31
  Bottom 0.203: v5.78,50.31 7.81,52.34 7.81,52.95 C19.1
N$5  (via drill 0.35)
  Top 0.203: v3.14,34.66 4.35,35.88 LED2.A
  Bottom 0.203: v3.14,34.66 3.14,32.63 2.53,32.02 R11.2
N$6  (via drill 0.35)
  Top 0.203: v22.85,36.29 22.85,10.69 17.16,5 9.64,5 9.43,5.2 9.43,6.01 MICRO-USB.D-
  Bottom 0.203: v22.85,36.29 22.85,42.38 21.22,44.01 20.61,44.01 18.99,45.63 18.99,45.76 18.58,46.17 18.58,46.85 R10.1
N$7  (via drill 0.35)
  Top 0.203: v16.95,21.86 16.95,25.11 14.72,27.35 Y1.2 | v16.55,36.29 16.55,35.07 IC1.5
  Bottom 0.203: v16.95,21.86 15.73,21.86 C4.1 | Y1.2 14.72,27.55 16.55,29.38 16.55,30.67 16.37,30.85 16.37,31.79 16.72,32.15 16.72,32.81 16.55,32.98 16.55,33.11 16.27,33.39 16.27,34 16.55,34.28 v16.55,36.29
N$8  (via drill 0.35)
  Top 0.203: v5.98,16.78 5.98,14.95 10.04,10.89 10.04,6.21 MICRO-USB.D+
  Bottom 0.203: v5.98,16.78 5.98,18 R13.1
N$9  (via drill 0.35)
  Top 0.203: Y1.1 v19.8,20.64 | IC1.6 17.01,33.7 v17,33.69
  Route2 0.203: v17,33.69 19.8,30.89 Y1.1
  Bottom 0.203: v19.8,20.64 19.8,20.85 18.98,21.66 C8.1
N$10  (via drill 0.35)
  Top 0.203: v7,12.72 7,7.84 8.62,6.21 MICRO-USB.VBUS
  Bottom 0.203: v7,12.72 7,13.53 5.98,14.55 C6.1
N$11
  Bottom 0.203: R4.2 24.47,17.8 30.77,17.8 32.19,19.22 PY1.2
N$12
  Bottom 0.203: R15.2 31.79,32.02 31.79,27.55 31.99,27.35 PY2.2
N$13
  Bottom 0.203: R15.1 29.75,32.02 28.33,32.02 26.91,30.6 25.49,30.6 25.08,31.01 25.08,31.41 24.06,32.43 MOSFET-2.2
N$14
  Bottom 0.203: R4.1 24.27,19.22 23.46,18.41 23.46,15.16 24.27,14.34 MOSFET-1.2
N$16  (via drill 0.35)
  Top 0.203: v4.76,46.45 5.37,45.84 5.37,45.43 IMU.10
  Route2 0.203: v7.77,43.23 4.76,46.25 v4.76,46.45
  Bottom 0.203: v7.77,43.23 5.81,41.26 C22.2
N$17
  Bottom 0.203: R7.1 30.36,50.11 30.36,48.89 32.19,47.06 32.19,39.34 33.41,38.12 SERVO_X.2
N$18
  Bottom 0.203: R8.1 28.54,43.81 28.54,42.18 27.32,40.96 27.32,39.34 28.54,38.12 SERVO_Y.2
PA6
  Top 0.203: SERVO_X.3 33.41,40.56 32.19,39.34 32.19,36.49 29.35,33.65 28.13,33.65 24.61,37.16 24.27,37.51 23.49,38.29 IC1.16
PA7  (via drill 0.35)
  Top 0.203: v21.83,35.68 20.81,36.69 20.81,38.52 21.02,38.73 21.63,38.73 IC1.17 | v25.69,40.76 28.54,40.76 SERVO_Y.3
  Bottom 0.203: v21.83,35.68 22.24,35.68 22.44,35.48 23.25,35.48 25.69,37.91 v25.69,40.76
PA9  (via drill 0.35)
  Top 0.203: IC1.30 17.51,44.95 v17.85,45.29
  Route2 0.203: v17.85,45.29 17.25,45.88 v17.25,49.1
  Route15 0.203: v17.25,49.1 16.32,50.03 11.24,50.03 4.98,56.3 4.98,61.71 3.62,63.07 SERIAL.2
PA10  (via drill 0.35)
  Top 0.203: IC1.31 17.01,43.51 v17.76,42.75
  Route15 0.203: SERIAL.1 3.96,59.51 3.96,56.04 11.84,48.17 11.84,47.49 16.58,42.75 v17.76,42.75
PA11  (via drill 0.35)
  Top 0.203: v20.2,45.64 18.54,45.64 18.15,46.02 17.54,46.02 17.15,45.64 16.51,45.64 IC1.32
  Bottom 0.203: v20.2,45.64 20.2,46.85 R10.2
PA12  (via drill 0.35)
  Top 0.203: IC1.33 v16.01,46.28
  Route15 0.203: v16.41,41.4 16.41,37.19 15.81,36.59 15.81,34.96 v11.75,30.9
  Bottom 0.203: R6.2 9.03,13.94 9.03,16.58 5.98,19.63 R13.2 11.75,25.74 v11.75,30.9 | v16.41,41.4 16.41,45.88 v16.01,46.28
PB0  (via drill 0.35)
  Top 0.203: v5.98,46.45 6.39,46.04 6.39,45.43 IMU.12 | v2.73,43.2 2.73,39.34 5.37,36.69 5.37,31.41 7.4,29.38 16.14,29.38 16.54,29.78 18.15,29.78 19.05,30.68 19.05,32.29 21.02,34.26 21.02,35.88 20.41,36.49 20.41,38.73 21.02,39.34 21.63,39.34 IC1.18
  Bottom 0.203: v2.73,43.2 v5.98,46.45
PB1
  Top 0.203: BUZZER.+ 28.33,9.87 34.83,16.37 34.83,41.17 34.02,41.98 33.01,41.98 31.79,40.76 31.79,36.69 29.14,34.05 28.33,34.05 26.91,35.48 26.91,36.9 24.02,39.79 IC1.19
PB6  (via drill 0.35)
  Top 0.203: v27.32,43.2 v27.32,53.15 | v14.72,39.74 12.89,39.74 IC1.42
  Bottom 0.203: v27.32,53.15 26.71,53.76 26.1,53.76 R14.1 | v27.32,43.2 27.32,41.57 26.5,40.76 26.5,36.9 22.85,33.24 | 22.85,33.24 22.85,31.82 23.86,30.8 MOSFET-2.1 | v14.72,39.74 16.34,39.74 22.85,33.24
PB7  (via drill 0.35)
  Top 0.203: IC1.43 10.73,39.29 10.21,39.81 10.21,42.75 11.67,44.21 v11.67,45.23
  Route2 0.203: v18.98,53.56 16.95,51.53 16.95,50.51 v11.67,45.23
  Bottom 0.203: v18.98,53.56 19.19,53.76 20.2,53.76 R5.1 | v11.67,45.23 11.67,39.34 13.5,37.51 16.55,37.51 17.36,36.69 17.36,34.37 17.73,34 17.73,33.39 17.36,33.02 17.36,32.21 16.77,31.63 16.77,31.02 17.36,30.43 17.36,26.94 23.46,20.85 32.8,20.85 33.82,19.83 33.82,18.81 32.8,17.8 31.99,17.8 30.77,16.58 30.77,15.77 27.32,12.31 24.47,12.31 MOSFET-1.1
PB8  (via drill 0.35)
  Top 0.203: IC1.45 10.03,38.29 9.8,38.52 v9.8,44.28 | IMU.24 3.88,49.19 3.88,50.79 5.21,52.13 7.69,52.13 8.77,51.05 8.77,49.96 9.8,48.93 v9.8,46.65
  Bottom 0.203: v9.8,44.28 v9.8,46.65
PB9  (via drill 0.35)
  Top 0.203: v5.98,47.67 5.37,47.67 4.35,48.68 4.35,49.09 IMU.23 | IC1.46 9.35,37.79 8.62,38.52 v8.62,45.03
  Route2 0.203: v8.62,45.03 v5.98,47.67
PC13  (via drill 0.35)
  Top 0.203: IC1.2 15.01,33.14 v15.05,33.1 | LED2.C 7.13,35.22 v12.09,35.22
  Route2 0.203: v12.09,35.22 12.94,35.22 v15.05,33.1
PC14  (via drill 0.35)
  Top 0.203: v14.92,36.29 15.53,35.68 15.53,35.07 IC1.3 | v12.08,33.44 10.86,33.44 8.01,30.6 Y2.2
  Bottom 0.203: C10.1 2.12,27.75 5.17,27.75 7.81,30.4 Y2.2 | v12.08,33.44 v14.92,36.29
PC15  (via drill 0.35)
  Top 0.203: IC1.4 16.01,33.76 16.19,33.57 16.19,33.02 15.98,32.81 v15.98,32.51
  Route15 0.203: Y2.1 14.83,32.37 15.36,32.37 15.5,32.51 v15.98,32.51
  Bottom 0.203: C16.1 2.12,21.05 3.54,21.05 7.81,25.32 Y2.1
RESET  (via drill 0.35)
  Top 0.203: v10.25,17.59 13.5,17.59 v13.9,18 | IC1.7 17.51,34.22 17.73,34 17.73,33.39 17.51,33.16 v17.51,31.32 | SWITCH.2 13.9,16.92 v13.9,18 | v18.02,20.74 15.28,18 v13.9,18
  Route2 0.203: v17.51,31.32 17.51,22.34 17.69,22.17 17.69,21.07 v18.02,20.74
  Bottom 0.203: v10.25,17.59 9.23,18.61 R3.1 | v13.9,18 12.89,18 C12.1
SWDCLK  (via drill 0.35)
  Top 0.203: v12.89,43.2 12.89,42.38 IC1.37 | v16.14,51.12 16.14,62.91 18.98,65.75 SWD.2
  Bottom 0.203: v12.89,43.2 12.89,47.87 v16.14,51.12
SWDIO  (via drill 0.35)
  Top 0.203: v15.73,48.07 15.73,50.31 15.33,50.72 15.33,64.74 16.34,65.75 SWD.3 | IC1.34 15.53,44.01 15.53,43.4 15.73,43.2 16.74,43.2 17.03,42.91 17.03,42.45 17.46,42.02 18.07,42.02 18.49,42.45 18.49,43.2 v20.81,43.2
  Bottom 0.203: v15.73,48.07 17.77,46.04 18.13,46.04 18.58,45.6 18.58,45.43 v20.81,43.2
VCC3V3
  Top 0.203: 9.03,45.95 IMU.13 7,45.84 7,43.59 6.32,42.91 5.05,42.91 4.35,43.6 4.4,43.53 | 9.03,45.95 9.14,45.95 9.21,45.88 | IMU.8 4.4,43.53 | 4.4,43.53 4.39,43.51 | 13.39,36.2 14.51,35.07 IC1.1 14.51,33.59 14.32,33.4 14.32,32.8 14.75,32.37 15.09,32.37 15.68,31.77 16.29,31.77 16.94,32.43 16.94,31.79 16.77,31.63 16.77,31.02 17.2,30.59 17.81,30.59 18.24,31.02 18.24,31.63 17.97,31.9 17.97,32.77 18.55,33.34 18.55,34.33 18.51,34.37 IC1.9 | 13.39,36.2 12.89,36.69 IC1.48 | 9.03,45.95 9.03,46.04 9.37,46.04 9.5,45.91 10.11,45.91 10.24,46.04 13.9,46.04 | 15.53,42.38 14.51,43.4 14.51,44.01 IC1.36 14.51,45.84 14.37,45.97 14.31,46.04 13.9,46.04 | 13.39,36.2 15.53,38.34 15.53,42.38 | 13.9,46.04 13.9,65.75 SWD.4 | 15.53,42.38 15.63,42.29 16.61,42.29 17.29,41.61 18.23,41.61 18.91,42.29 IC1.24
  Bottom 0.203: 23.46,46.04 23.46,46.85 C5.2 23.25,47.06 23.25,48.07 16.75,54.58 C1.1 | 23.46,46.04 23.46,44.01 C18.2 | 23.46,46.04 25.08,46.04 25.89,46.85 28.33,46.85 C17.1 | R9.1 8.01,59.45 10.25,57.22 10.25,54.78 C2.1 10.45,54.78 16.55,54.78 C1.1 | C1.1 16.75,54.78 20,58.03 20,60.27 IC2.4 20,60.47 19.39,60.47 14.11,65.75 SWD.4 | R3.2 9.23,20.24 11.87,17.59 11.87,14.34 14.31,11.9 HEADER.2 | 8.22,32.02 10.86,34.66 10.86,35.07 C15.2 | 8.22,32.02 7.86,32.02 4.15,32.02 R11.1 3.95,32.02 3.95,39.95 2.73,41.17 C23.2 | 9.23,20.44 R3.2 | R3.2 12.94,24.3 12.94,31.58 12.49,32.02 8.22,32.02
  pour Route2: -10.09,78.65 48.07,78.65 48.07,-1.78 -10.09,-1.78

### Text on the board
Top: 1层
Route2: 2层
Route15: 3层
Bottom: 4层
tPlace: SPACE PIRATE V1.0.1 | 3.3V | SWDIO | GND | PA9 | SWDCLK | PA10 | + | - | S | + | -